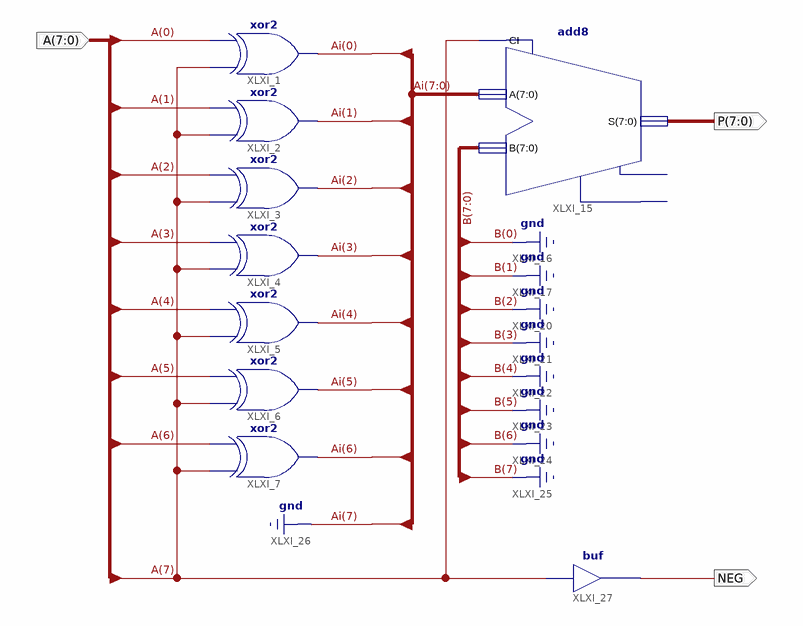
[diagram p0: schematic sheet 1]
// Xilinx ISE schematic tcd8.sch (spartan6) as structural Verilog: 9 symbols, 3 ports
module tcd8 (
  input  [7:0] A,
  output NEG,
  output [7:0] P
);

  wire [6:0] Ai;

  xor XLXI_1 (Ai[0], A[7], A[0]);
  xor XLXI_2 (Ai[1], A[7], A[1]);
  xor XLXI_3 (Ai[2], A[7], A[2]);
  xor XLXI_4 (Ai[3], A[7], A[3]);
  xor XLXI_5 (Ai[4], A[7], A[4]);
  xor XLXI_6 (Ai[5], A[7], A[5]);
  xor XLXI_7 (Ai[6], A[7], A[6]);
  add8 XLXI_15 (.A({1'b0, Ai}), .B({8{1'b0}}), .CI(A[7]), .S(P));  // open: CO, OFL
  buf XLXI_27 (NEG, A[7]);
endmodule
